# EAGLE design Lilypad_Arduino_USB (EAGLE 6.5.0)
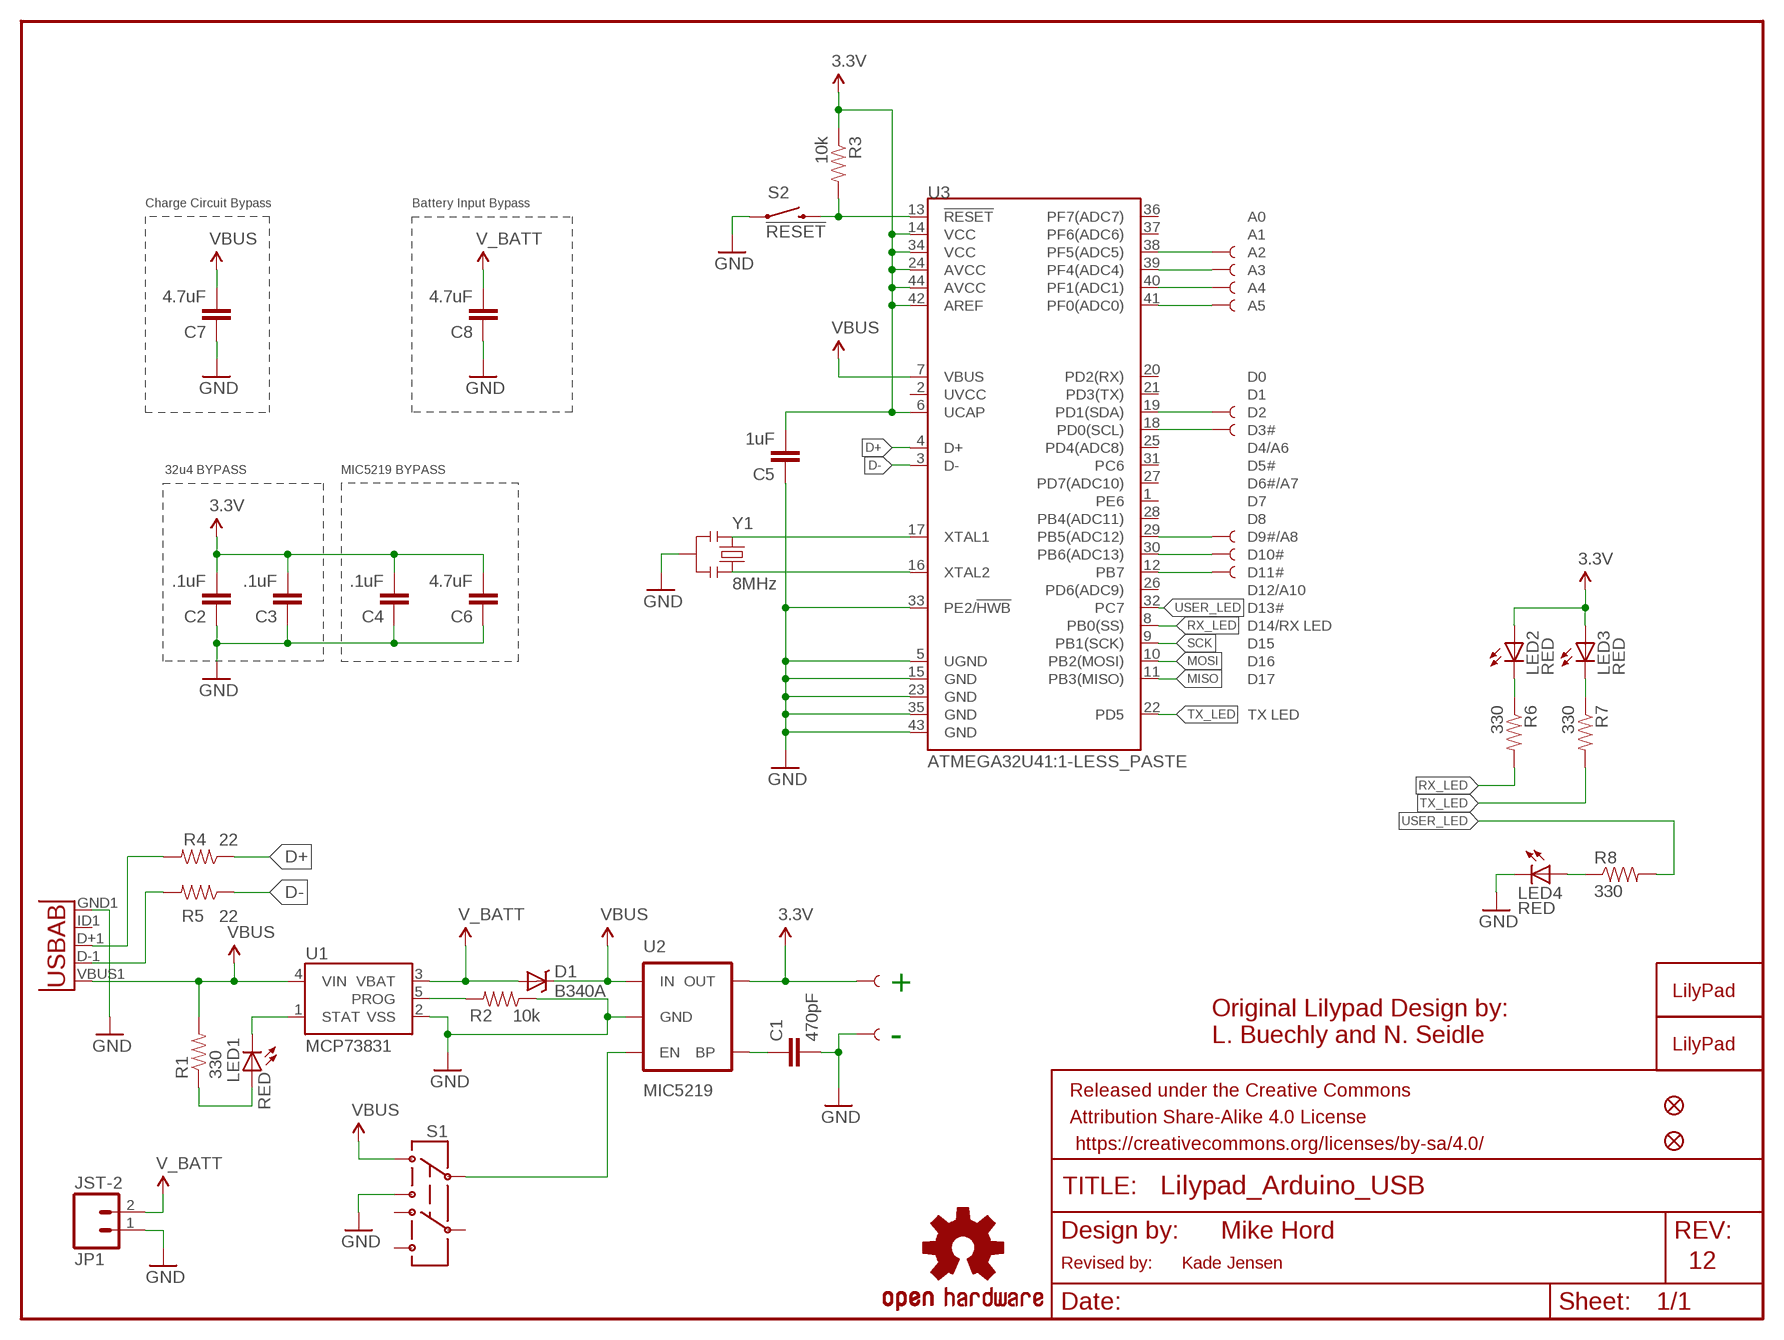
[diagram p0: schematic, sheet 1]

## Parts
+  SEWTAP9  [PETAL-LONG-1-2SIDE]
-  SEWTAP9  [PETAL-LONG-1-2SIDE]
A2  SEWTAP9  [PETAL-LONG-1-2SIDE]
A3  SEWTAP9  [PETAL-LONG-1-2SIDE]
A4  SEWTAP9  [PETAL-LONG-1-2SIDE]
A5  SEWTAP9  [PETAL-LONG-1-2SIDE]
C1  470pF  CAP0603-CAP  [0603-CAP]
C2  .1uF  CAP0603-CAP  [0603-CAP]
C3  .1uF  CAP0603-CAP  [0603-CAP]
C4  .1uF  CAP0603-CAP  [0603-CAP]
C5  1uF  CAP0603-CAP  [0603-CAP]
C6  4.7uF  CAP0603-CAP  [0603-CAP]
C7  4.7uF  CAP1206  [1206]
C8  4.7uF  CAP1206  [1206]
D1  B340A  DIODE-SCHOTTKY-B340A  [SMA-DIODE]
D5  SEWTAP9  [PETAL-LONG-1-2SIDE]
D6  SEWTAP9  [PETAL-LONG-1-2SIDE]
D9  SEWTAP9  [PETAL-LONG-1-2SIDE]
D10  SEWTAP9  [PETAL-LONG-1-2SIDE]
D11  SEWTAP9  [PETAL-LONG-1-2SIDE]
FRAME1  FRAME-LETTER  [CREATIVE_COMMONS]
JP1  JST-2  M02-JST-2MM-SMT  [JST-2-SMD]
JP2  FIDUCIAL1X2  [FIDUCIAL-1X2]
JP3  FIDUCIAL1X2  [FIDUCIAL-1X2]
LED1  RED  LED0603  [LED-0603]
LED2  RED  LED0603  [LED-0603]
LED3  RED  LED0603  [LED-0603]
LED4  RED  LED0603  [LED-0603]
R1  330  RESISTOR0603-RES  [0603-RES]
R2  10k  RESISTOR0603-RES  [0603-RES]
R3  10k  RESISTOR0603-RES  [0603-RES]
R4  22  RESISTOR0603-RES  [0603-RES]
R5  22  RESISTOR0603-RES  [0603-RES]
R6  330  RESISTOR0603-RES  [0603-RES]
R7  330  RESISTOR0603-RES  [0603-RES]
R8  330  RESISTOR0603-RES  [0603-RES]
S1  SWITCH-DPDTAYZ0202  [AYZ0202]
S2  !RESET  SWITCH-MOMENTARY-2SMD  [TACTILE_SWITCH_SMD]
U1  MCP73831  [SOT23-5]
U2  MIC5219  V_REG_MIC52193.3V  [SOT23-5]
U3  ATMEGA32U41:1-LESS_PASTE  [QFN-44-NOPAD_1:1-LESS_PASTE]
U5  USB-ABCONN-11794  [USB-AB-MICRO-SMD_V03]
U$1  LOGO-LPLPA  [LOGO-LPA]
U$5  OSHW-LOGOM  [OSHW-LOGO-M]
U$13  LOGO-LPLP  [LOGO-LILYPAD]
Y1  8MHz  RESONATOR8MHZ  [RESONATOR-SMD]

## Nets
3.3V: +.1 C2.2 C3.2 C4.2 C5.2 C6.2 LED2.A LED3.A R3.1 U2.5(OUT) U3.6(UCAP) U3.14(VCC) U3.24(AVCC) U3.34(VCC) U3.42(AREF) U3.44(AVCC)
5V: C7.2 D1.C R1.2 S1.1 U1.4(VIN) U2.1(IN) U3.7(VBUS) U5.VBUS1(VBUS) ; supply symbol labelled VBUS
D+: R4.1 U3.4(D+)
D-: R5.1 U3.3(D-)
GND: -.1 C1.2 C2.1 C3.1 C4.1 C5.1 C6.1 C7.1 C8.1 JP1.1 LED4.C R2.1 S1.3 S2.1 U1.2(VSS) U2.2(GND) U3.5(UGND) U3.15(GND) U3.23(GND) U3.33(PE2/!HWB) U3.35(GND) U3.43(GND) U5.GND1(GND) Y1.2
MISO: U3.11(PB3(MISO))
MOSI: U3.10(PB2(MOSI))
N$1: LED2.C R6.1
N$2: S1.2 U2.3(EN)
N$3: LED1.A R1.1
N$4: LED1.C U1.1(STAT)
N$5: U3.17(XTAL1) Y1.1
N$6: R2.2 U1.5(PROG)
N$7: U3.16(XTAL2) Y1.3
N$8: C1.1 U2.4(BP)
N$9: D11.1 U3.12(PB7)
N$10: D10.1 U3.30(PB6(ADC13))
N$11: D9.1 U3.29(PB5(ADC12))
N$12: D5.1 U3.19(PD1(SDA))
N$13: D6.1 U3.18(PD0(SCL))
N$14: A5.1 U3.41(PF0(ADC0))
N$15: A4.1 U3.40(PF1(ADC1))
N$16: A3.1 U3.39(PF4(ADC4))
N$17: A2.1 U3.38(PF5(ADC5))
N$18: LED4.A R8.1
N$19: R5.2 U5.D-1(D-)
N$20: R4.2 U5.D+1(D+)
N$21: LED3.C R7.1
RESET: R3.2 S2.3 U3.13(!RESET)
RX_LED: R6.2 U3.8(PB0(SS))
SCK: U3.9(PB1(SCK))
TX_LED: R7.2 U3.22(PD5)
USER_LED: R8.2 U3.32(PC7)
V_BATT: C8.2 D1.A JP1.2 U1.3(VBAT)
Unconnected: S1.4 S1.5 S1.6 U3.1(PE6) U3.2(UVCC) U3.20(PD2(RX)) U3.21(PD3(TX)) U3.25(PD4(ADC8)) U3.26(PD6(ADC9)) U3.27(PD7(ADC10)) U3.28(PB4(ADC11)) U3.31(PC6) U3.36(PF7(ADC7)) U3.37(PF6(ADC6)) U5.ID1(USBID)

## Notes on the sheet
- Charge Circuit Bypass | Battery Input Bypass
- 32u4 BYPASS | MIC5219 BYPASS
- +
- Original Lilypad Design by:
- - | L. Buechly and N. Seidle
- Mike Hord
- Revised by: | Kade Jensen | 12

## Library data of the parts
+ - A2-A5 D5 D6 D9-D11 = LilyPad-Wearables:SEWTAP; NO_PART: 1
C1 = SparkFun-Passives:CAP: Capacitor Standard 0603 ceramic capacitor, and 0.1" leaded capacitor.; PROD_ID: CAP-07884
C2-C4 = SparkFun-Passives:CAP: Capacitor Standard 0603 ceramic capacitor, and 0.1" leaded capacitor.; PROD_ID: CAP-00810
C5 = SparkFun-Passives:CAP: Capacitor Standard 0603 ceramic capacitor, and 0.1" leaded capacitor.; PROD_ID: CAP-00868
C6 = SparkFun-Passives:CAP: Capacitor Standard 0603 ceramic capacitor, and 0.1" leaded capacitor.; PROD_ID: CAP-08280
C7 C8 = SparkFun-Passives:CAP: Capacitor Standard 0603 ceramic capacitor, and 0.1" leaded capacitor.; PROD_ID: CAP-10300
D1 = SparkFun-DiscreteSemi:DIODE-SCHOTTKY: Schottky diodes in SFE's production catalog BAT20J 1A 23V 0.62Vf RB751 120mA 40V 0.37Vf PMEG4005EJ 0.5A 40V 0.42Vf MBRA140 1A 40V 0.5Vf B340A 3A 40V SMA; PROD_ID: DIO-09886
FRAME1 = SparkFun-Aesthetics:FRAME-LETTER: Schematic Frame Standard 8.5x11 US Letter frame
JP1 = SparkFun-Connectors:M02: Standard 2-pin 0.1" header. Use with - straight break away headers ( PRT-00116) - right angle break away headers (PRT-00553) - swiss pins (PRT-00743) - machine pins (PRT-00117) - female headers (PRT-00115) Molex polarized connector foot print use with: PRT-08233 with associated crimp pins and housings. 2.54_SCREWTERM for use with PRT-10571. 3.5mm Screw Terminal footprints for PRT-08084 5mm Screw Terminal footprints for use with PRT-08433; PROD_ID: CONN-08352
JP2 JP3 = SparkFun:FIDUCIAL: Fiducial Alignment Points Various fiducial points for machine vision alignment.
LED1-LED4 = SparkFun-LED:LED: LEDs Standard schematic elements and footprints for 5mm, 3mm, 1206, and 0603 sized LEDs. 5mm - Spark Fun Electronics SKU : COM-00529 (and others); PROD_ID: DIO-00819
R1 R7 R8 = SparkFun-Passives:RESISTOR: Resistor Basic schematic elements and footprints for 0603, 1206, and PTH resistors.; PROD_ID: RES-00818
R2 R3 = SparkFun-Resistors:RESISTOR: Resistor Basic schematic elements and footprints for 0603, 1206, and PTH resistors.; PROD_ID: RES-00824
R4 R5 = SparkFun-Resistors:RESISTOR: Resistor Basic schematic elements and footprints for 0603, 1206, and PTH resistors.; PROD_ID: RES-08698
R6 = SparkFun-Resistors:RESISTOR: Resistor Basic schematic elements and footprints for 0603, 1206, and PTH resistors.; PROD_ID: RES-00818
S1 = SparkFun-Electromechanical:SWITCH-DPDT: DPDT Version of the COM-00597; PROD_ID: SWCH-08179; VALUE: DPDT
S2 = SparkFun-Electromechanical:SWITCH-MOMENTARY-2: Various NO switches- pushbuttons, reed, etc; PROD_ID: SWCH-08247
U1 = SparkFun-PowerIC:MCP73831: Miniature single cell, fully integrated Li-Ion, Li-polymer charge management controller http://ww1.microchip.com/downloads/en/DeviceDoc/21984a.pdf IC-09995; PROD_ID: IC-09995
U2 = SparkFun-PowerIC:V_REG_MIC5219: V_REG MIC5219 Standard 3.3V and 5V 500mA LDO voltage regulator in SOT-23 layout. Micrel part MIC5219. BP (by-pass) pin is used to lower output noise with 470pF cap, may be left open.; PROD_ID: VREG-09872; VALUE: MIC5219 3.3V
U3 = Testing:ATMEGA32U4: Atmel 44-pin 8-bit Microcontroller with 32KBytes of ISP Flash and USB Controller; PROD_ID: IC-10828
U5 = SparkFun-Connectors:USB-AB: This is a USB AB connector that is compatible with USB OTG. i.e. this connector can serve as a host or device; PROD_ID: CONN-11794
U$1 = LilyPad-Wearables:LOGO-LP
U$5 = SparkFun:OSHW-LOGO: Open Source Hardware Logo This logo indicates the piece of hardware it is found on incorporates a OSHW license and/or adheres to the definition of open source hardware found here: http://freedomdefined.org/OSHW
U$13 = LilyPad-Wearables:LOGO-LP; NO_PART: 1
Y1 = SparkFun-FreqCtrl:RESONATOR: Resonator Small SMD resonator. Used, eg, on the Arduino Pro/ Pro Mini boards. 8MHz- XTAL-08895 16MHz- XTAL-08900; PROD_ID: XTAL-08895; VALUE: 8MHZ

## Board
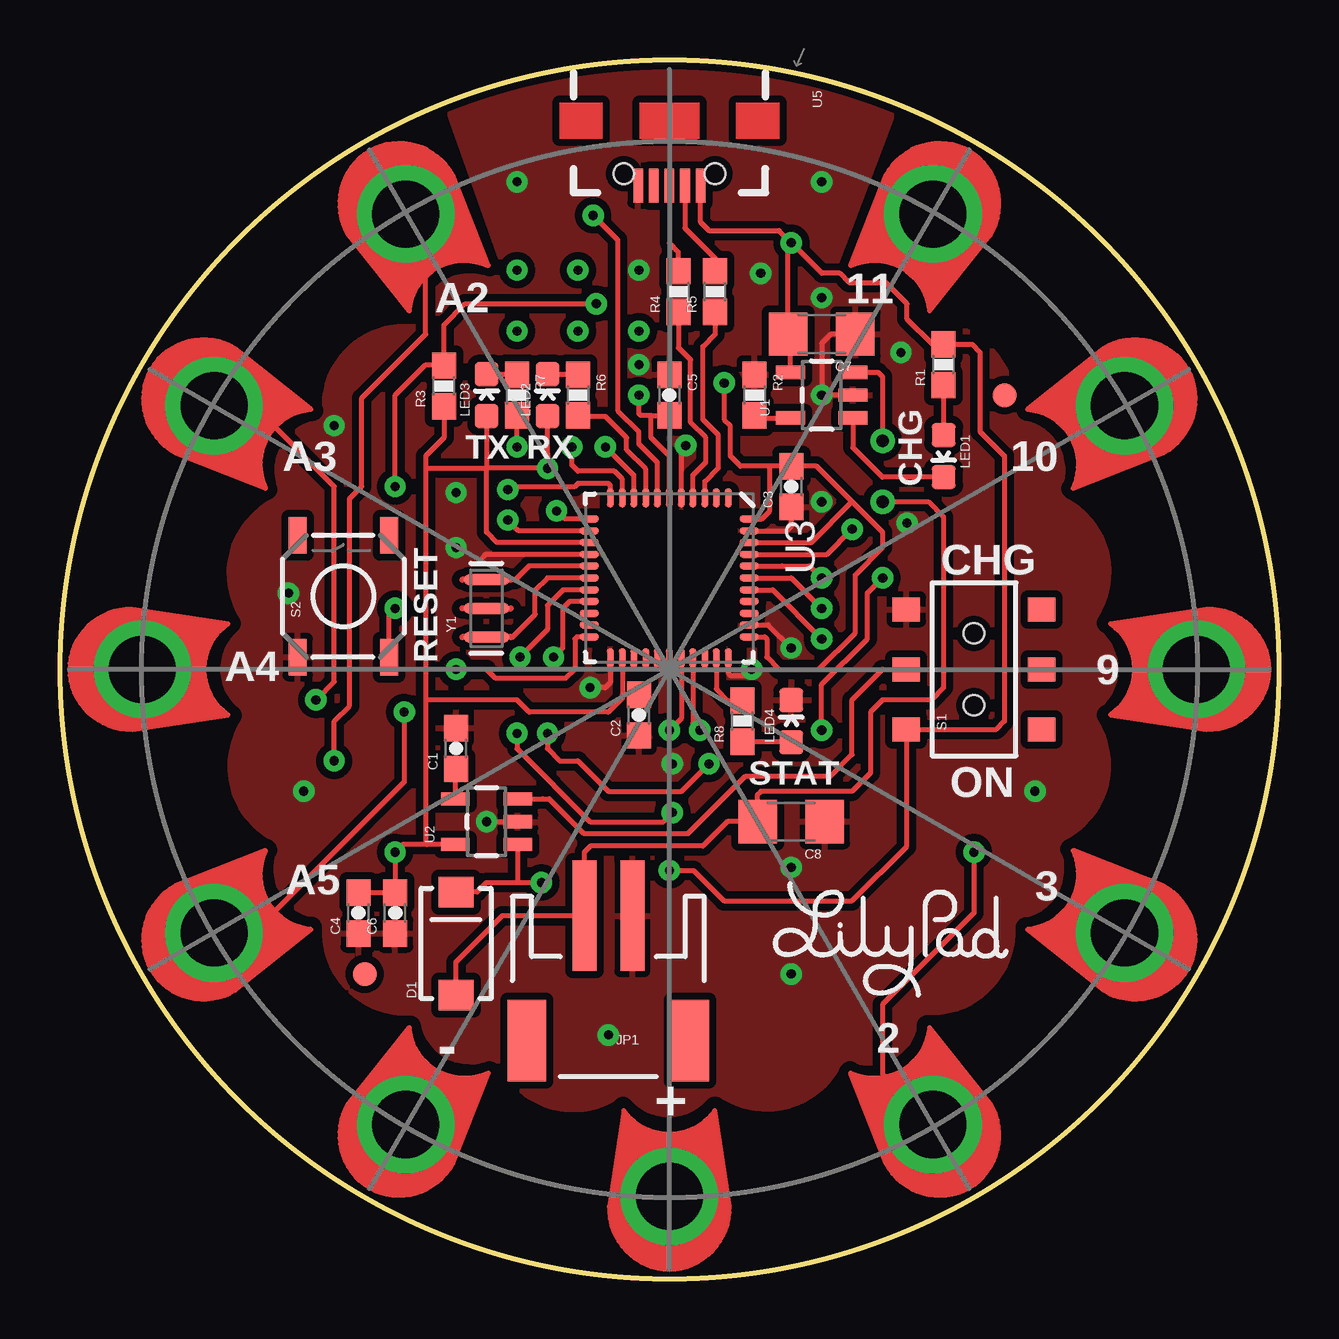
[diagram p1: board, top side]
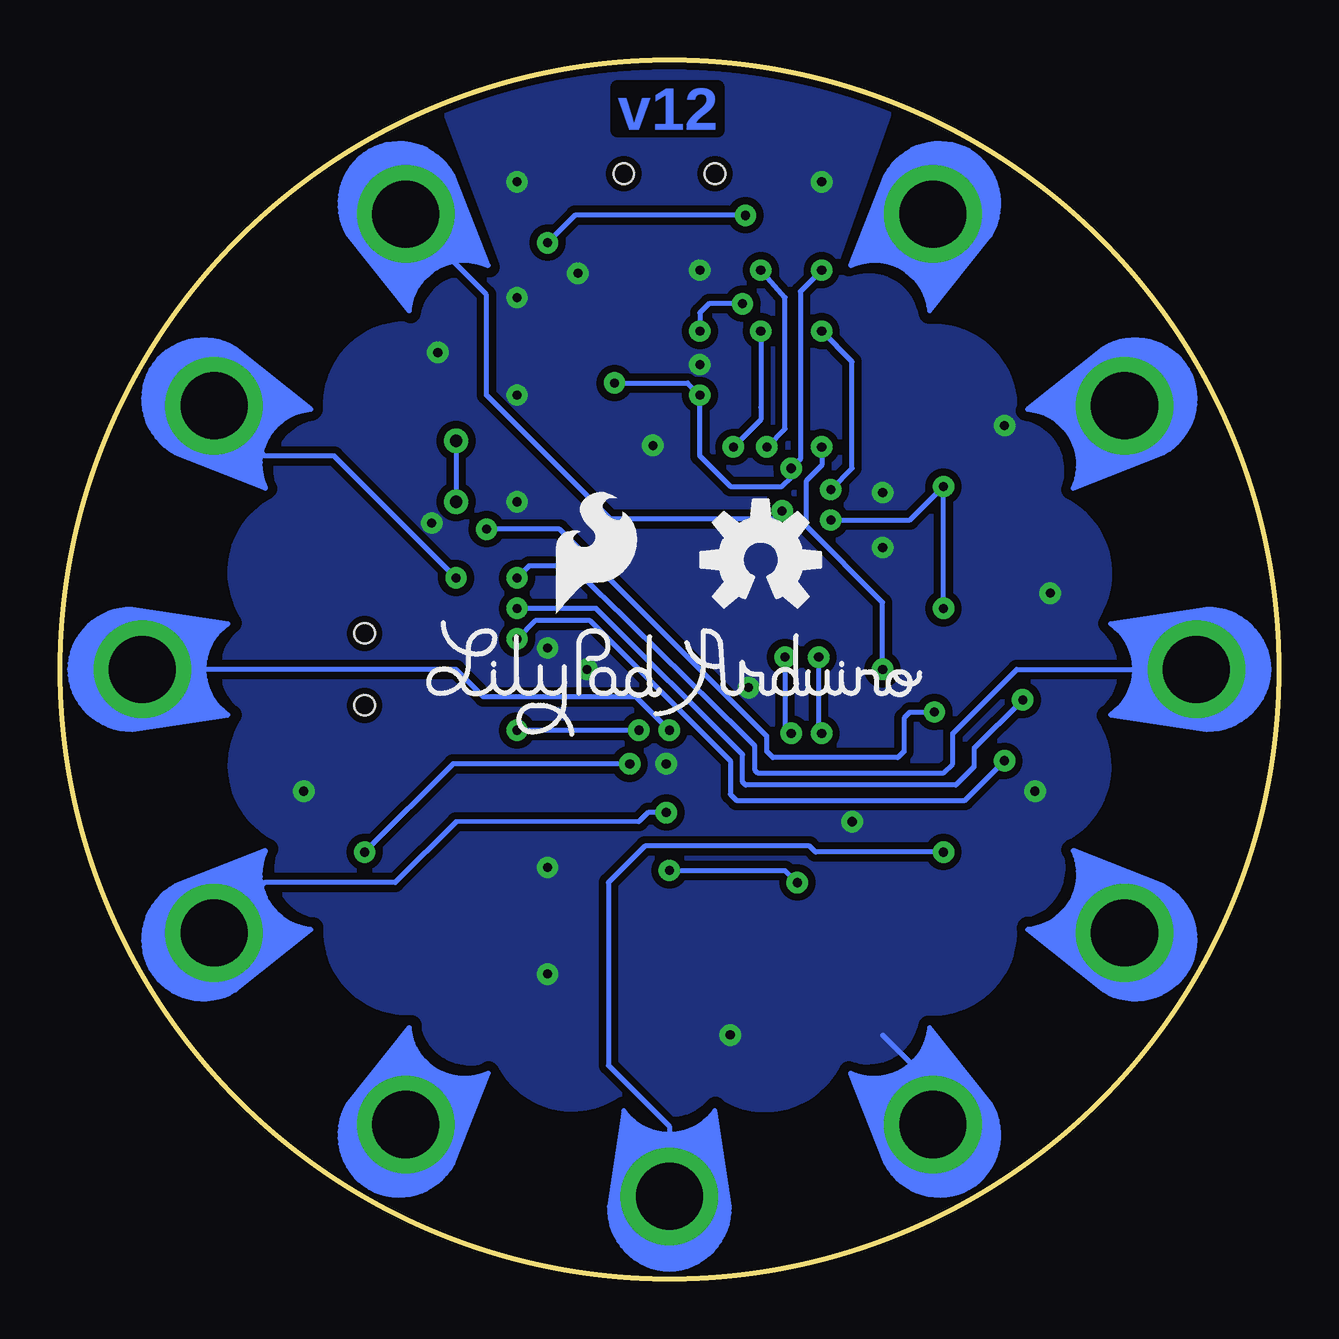
[diagram p2: board, bottom side, seen from below]

Size 50.8 x 50.8 mm. Coordinates in mm from the lower left corner, seen from the top.
Outline: circle at 25.4,25.4 radius 25.4
Copper layers (1*16): Top 0.035mm / dielectric 1.5mm / Bottom 0.035mm
Design rules "SparkFun-2-layer": minimum track width 7mil, minimum drill 15mil, track to track 8mil, track to pad 8mil, pad to pad 8mil, via to via 8mil, smd to smd 8mil, copper to edge 8mil, drill to drill 8mil, minimum pad ring 12mil, minimum via ring 10mil, stop-mask expansion 4mil, vias tented up to drill 20mil, thermal gap 10mil
tRestrict: area 2.1,32.9 to 10.5,40.7; area 40.3,10.1 to 48.7,17.9; area 0.3,22.4 to 7.1,28.6; area 43.7,22.2 to 50.5,28.4; area 32.9,2 to 40.6,10.5; area 40.3,32.9 to 48.8,40.6; area 2,10.2 to 10.5,17.9; area 10.2,40.3 to 17.9,48.8; area 32.9,40.3 to 40.7,48.7; area 10.1,2.1 to 17.9,10.5; area 0.3,27.3 to 8.6,35.3; area 5.2,36.2 to 14.6,45.6; area 42.2,27.3 to 50.5,35.3; area 36.2,36.2 to 45.6,45.6; area 5.2,5.2 to 14.6,14.7; area 0.3,15.5 to 8.6,23.5; area 27.3,0.3 to 35.3,8.6; area 15.5,0.3 to 23.5,8.6; area 36.1,5.2 to 45.6,14.6; area 42.1,15.5 to 50.5,23.5; area 22.2,0.3 to 28.4,7.2; area 22.5,25.5 to 22.6,26; area 22.9,26.7 to 27.9,31.8; area 28.1,25.8 to 28.3,26.2
bRestrict: area 0.3,22.4 to 7.1,28.6; area 43.7,22.2 to 50.5,28.4; area 32.9,2 to 40.6,10.5; area 40.3,32.9 to 48.8,40.6; area 2,10.2 to 10.5,17.9; area 10.2,40.3 to 17.9,48.8; area 32.9,40.3 to 40.7,48.7; area 10.1,2.1 to 17.9,10.5; area 0.3,27.3 to 8.6,35.3; area 5.2,36.2 to 14.6,45.6; area 42.2,27.3 to 50.5,35.3; area 36.2,36.2 to 45.6,45.6; area 5.2,5.2 to 14.6,14.7; area 0.3,15.5 to 8.6,23.5; area 27.3,0.3 to 35.3,8.6; area 15.5,0.3 to 23.5,8.6; area 36.1,5.2 to 45.6,14.6; area 42.1,15.5 to 50.5,23.5; area 22.2,0.3 to 28.4,7.2; area 2.1,32.9 to 10.5,40.7; area 40.3,10.1 to 48.7,17.9

### Footprints (pad centres in the part's own frame; a part is rotated, then mirrored left to right if it is on the bottom)
PETAL-LONG-1-2SIDE = drill 2.794 pad 4.064: 1 0.03,0
0603-CAP = smd 1.1 x 1: 1 -0.85,0; 2 0.85,0
1206 = smd 1.6 x 1.8: 1 -1.4,0; 2 1.4,0
SMA-DIODE = smd 1.27 x 1.47: A -2.15,0; C 2.15,0
JST-2-SMD = smd 1 x 4.6: 1 -1,-3.7; 2 1,-3.7 | smd 1.6 x 3.4: NC1 -3.4,1.5; NC2 3.4,1.5
FIDUCIAL-1X2 = smd 1 x 1: 1 0,0
LED-0603 = smd 1 x 1: A 0,-0.877; C 0,0.877
0603-RES = smd 1.1 x 1: 1 -0.85,0; 2 0.85,0
AYZ0202 = smd 1 x 1.15: 1 -2.5,2.825; 2 0,2.825; 3 2.5,2.825; 4 -2.5,-2.825; 5 0,-2.825; 6 2.5,-2.825 | hole 0.85: 1.5,0; -1.5,0
TACTILE_SWITCH_SMD = smd 1.524 x 0.762: 1 -2.54,1.905; 2 2.54,1.905; 3 -2.54,-1.905; 4 2.54,-1.905
SOT23-5 = smd 0.55 x 1.2: 1 -0.95,-1.3; 2 0,-1.3; 3 0.95,-1.3; 4 0.95,1.3; 5 -0.95,1.3
QFN-44-NOPAD_1:1-LESS_PASTE = smd 0.8 x 0.3: 1 -3.337,2.458; 2 -3.337,1.958; 3 -3.337,1.479; 4 -3.337,0.979; 5 -3.337,0.5; 6 -3.337,0; 7 -3.337,-0.5; 8 -3.337,-0.979; 9 -3.337,-1.479; 10 -3.337,-1.958; 11 -3.337,-2.458; 23 3.337,-2.458; 24 3.337,-1.958; 25 3.337,-1.479; 26 3.337,-0.979; 27 3.337,-0.5; 28 3.337,0; 29 3.337,0.5; 30 3.337,0.979; 31 3.337,1.479; 32 3.337,1.958; 33 3.337,2.458 | smd 0.3 x 0.8: 12 -2.458,-3.337; 13 -1.958,-3.337; 14 -1.479,-3.337; 15 -0.979,-3.337; 16 -0.5,-3.337; 17 0,-3.337; 18 0.5,-3.337; 19 0.979,-3.337; 20 1.479,-3.337; 21 1.958,-3.337; 22 2.458,-3.337; 34 2.458,3.337; 35 1.958,3.337; 36 1.479,3.337; 37 0.979,3.337; 38 0.5,3.337; 39 0,3.337; 40 -0.5,3.337; 41 -0.979,3.337; 42 -1.479,3.337; 43 -1.958,3.337; 44 -2.458,3.337
USB-AB-MICRO-SMD_V03 = smd 1.4 x 0.4: D+1 2.7,0; D-1 2.7,0.65; GND1 2.7,-1.3; ID1 2.7,-0.65; VBUS1 2.7,1.3 | hole 0.85: 2.2,1.9; 2.2,-1.9
RESONATOR-SMD = smd 0.45 x 1.905: 1 -1.2,0; 2 0,0; 3 1.2,0

### Placement (x,y rotation side)
+  25.4,3.4 90 top
-  14.4,6.4 60 top
A2  14.4,44.4 300 top
A3  6.4,36.4 330 top
A4  3.4,25.4 0 top
A5  6.4,14.4 30 top
C1  16.51,22.1 90 top
C2  24.13,23.5 90 top
C3  30.48,33.02 90 top
C4  12.45,15.24 90 top
C5  25.4,36.83 270 top
C6  13.97,15.24 90 top
C7  31.75,39.37 180 top
C8  30.48,19.05 180 top
D1  16.51,13.97 90 top
D5  36.4,6.4 120 top
D6  44.4,14.4 150 top
D9  47.4,25.4 180 top
D10  44.4,36.4 210 top
D11  36.4,44.4 240 top
FRAME1  -87.91,25.4 0 top  (outside the outline)
JP1  22.86,11.43 180 top
JP2  12.7,12.7 0 top
JP3  39.37,36.83 0 top
LED1  36.83,34.29 180 top
LED2  20.32,36.83 0 top
LED3  17.78,36.83 0 top
LED4  30.48,23.24 0 top
R1  36.83,38.1 90 top
R2  28.96,36.83 270 top
R3  16,37.21 90 top
R4  25.78,41.15 90 top
R5  27.3,41.15 90 top
R6  21.59,36.83 270 top
R7  19.05,36.83 270 top
R8  28.45,23.24 90 top
S1  38.1,25.4 90 top
S2  11.81,28.45 90 top
U1  31.75,36.83 90 top
U2  17.78,19.05 90 top
U3  25.4,29.21 270 top
U5  25.4,48.26 270 top
U$1  25.4,25.4 0 bottom
U$5  21.59,29.97 0 bottom
U$7  [SFE_LOGO_FLAME_.2]  30.48,27.43 0 bottom
U$13  34.67,14.48 0 top
Y1  17.78,27.94 90 top

### Tracks (layer width: path | path; a pad name or v marks a point on that pad's centre or on a via)
3.3V  (via drill 0.38)
  Top 0.203: 16.19,18.1 U2.5 15.3,18.1 | LED2.A 20.32,34.42 v20.32,33.78 17.78,33.78 | 15.3,18.1 15.24,18.16 15.24,24.13 | 15.3,18.1 14.29,18.1 v13.97,17.78 C6.2 C4.2 | R3.1 16,35.05 15.24,34.29 15.24,33.78 | 29.59,33.87 C3.2 31.53,33.87 33.02,32.38 | U3.44 29.25,31.67 29.59,32 29.59,33.87 | 15.24,24.13 19.05,24.13 19.56,23.62 22.86,23.62 23.44,24.2 23.44,24.34 | U3.24 23.44,24.34 | C2.2 23.44,24.34 | 24.64,35.98 24.22,35.98 24.13,36.07 v24.13,36.83 | U3.6 25.4,34.29 24.64,35.05 24.64,35.98 | 24.64,35.98 C5.2 | v27.69,37.34 27.69,35.81 27.94,35.56 27.94,34.29 28.36,33.87 29.59,33.87 | U3.34 29.38,26.75 29.46,26.67 29.46,25.91 29.97,25.4 31.62,25.4 33.15,26.92 33.15,29.34 34.29,30.48 34.29,31.11 33.02,32.38 | U3.42 31.32,30.69 33.02,32.38 | U3.14 18.21,30.69 17.78,31.11 17.78,33.78 | 15.24,33.78 17.78,33.78 | 17.78,33.78 | 17.78,33.78 | LED3.A 17.78,33.78 | 17.78,33.78 | 15.24,33.78 | 15.24,33.78 15.24,24.13
  Bottom 0.203: v19.05,42.04 19.94,41.15 19.94,34.16 v20.32,33.78 | v13.97,17.78 19.3,17.78 19.56,18.03 26.42,18.03 27.94,16.51 27.94,8.89 25.4,6.35 +.1 | v20.32,33.78 | v20.32,33.78 20.32,33.4 20.7,33.02 22.86,33.02 24.13,34.29 v24.13,36.83 24.64,37.34 v27.69,37.34
5V  (via drill 0.38)
  Top 0.203: U3.7 24.9,34.03 24.13,34.8 24.13,35.31 23.24,36.2 23.24,43.31 v22.22,44.32 | v25.4,17.02 26.42,17.02 27.69,15.75 33.02,15.75 35.27,18 S1.1 39.03,22.9 39.37,23.24 39.37,34.29 38.35,35.31 38.35,38.61 38.01,38.95 R1.2 36.36,38.95 35.31,40 35.31,40.64 34.42,41.53 32.89,41.53 32.51,41.91 31.75,41.91 v30.48,43.18 | v30.48,43.18 29.97,43.69 27.05,43.69 26.7,44.04 U5.VBUS1 | v30.48,43.18 30.35,43.05 C7.2 30.45,39.27 U1.4 | 19.05,16.51 17.78,16.51 17.39,16.12 D1.C | 19.05,16.51 v20.07,16.51 | v20.07,16.51 | U2.1 19.08,16.54 19.05,16.51 | D1.C | U5.VBUS1
  Bottom 0.203: v22.22,44.32 29.34,44.32 v30.48,43.18 | v25.4,17.02 20.57,17.02 v20.07,16.51
D+
  Top 0.203: R4.1 25.78,38.81 26.29,38.3 26.29,35.69 26.92,35.05 26.92,34.04 26.38,33.49 U3.4
D-
  Top 0.203: R5.1 27.3,39.37 26.8,38.86 26.8,35.81 27.43,35.18 27.43,33.78 26.88,33.23 U3.3
GND  (via drill 0.38)
  Top 0.203: U1.2 v31.75,36.83 31.75,38.99 32.13,39.37 C7.1 | U2.2 v17.78,19.05 | C3.1 30.48,31.37 30.28,31.17 U3.43 | U3.15 17.74,30.19 17.65,30.1 | U3.23 22.94,24.85 22.73,24.64 v22.1,24.64 | U3.5 25.9,34.55 v26.09,34.73 | U3.33 27.86,25.23 27.94,25.15 28.57,25.15 v28.83,25.4 | U3.35 29.52,27.25 v30.48,26.29
  Bottom 0.203: -.1 14.41,8.06 16.51,10.16
  other vias: 24.13,42.04 22.86,10.16 30.48,12.7 10.16,20.32 29.21,41.91 9.53,28.57 24.13,38.1 31.75,40.89 19.05,45.72 16.51,30.48 16.51,32.77 35.31,31.5 31.75,32.38 25.53,21.46 30.48,17.14 35.05,38.61 11.43,35.56 31.75,45.72 40.64,20.32
  pour Top (isolate 0.305): 50.8,25.4 arc90 25.4,50.8 arc90 0,25.4 arc90 25.4,0 arc90
  pour Bottom (isolate 0.305): 50.8,25.4 arc90 25.4,50.8 arc90 0,25.4 arc90 25.4,0 arc90
MISO  (via drill 0.38)
  Top 0.203: v18.67,32.89 18.8,33.02 21.46,33.02 21.59,33.15 22.86,33.15 22.94,33.06 U3.11
  Bottom 0.203: 17.78,33.78 17.78,38.23 v19.05,39.5 | 17.78,33.78 | 17.78,33.78 v18.67,32.89
MOSI  (via drill 0.38)
  Top 0.203: U3.10 23.44,33.33 23.11,33.66 21.59,33.66 21.34,33.91 v21.34,34.67
  Bottom 0.203: v21.59,42.04 20.57,40.89 20.57,35.43 v21.34,34.67
N$1
  Top 0.203: LED2.C 21.56,37.71 R6.1
N$2
  Top 0.203: U2.3 20.13,20 20.39,20 21.84,18.54 26.16,18.54 28.57,20.95 32.13,20.95 33.02,21.84 33.02,24.13 34.29,25.4 S1.2
N$3
  Top 0.203: R1.1 LED1.A
N$4
  Top 0.203: U1.1 33.05,34.64 34.28,33.41 LED1.C
N$5
  Top 0.203: Y1.1 18.87,26.74 19.81,27.69 19.81,28.7 20.32,29.21 | U3.17 20.32,29.21 | 20.32,29.21
N$6
  Top 0.203: R2.2 arc90 29.06,35.88 U1.5
N$7
  Top 0.203: Y1.3 18.98,29.14 19.55,29.71 U3.16
N$8
  Top 0.203: U2.4 16.48,21.22
  Top 0.254: 16.48,21.22 C1.1
N$9  (via drill 0.38)
  Top 0.203: U3.12 21.04,31.67 v20.7,32
  Bottom 0.203: v20.7,32 21.04,31.67 27.86,31.67 33.02,36.83 33.02,41.01 D11.1
N$10  (via drill 0.38)
  Top 0.203: v31.75,22.86 31.75,24.76 33.66,26.67 33.66,28.57 v34.29,29.21 | U3.30 26.38,23.15 v26.67,22.86
  Bottom 0.203: v26.67,22.86 v31.75,22.86 | v34.29,29.21 39.37,34.29 42.28,34.29 D10.1
N$11  (via drill 0.38)
  Top 0.203: U3.29 25.9,23.36 v25.4,22.86
  Bottom 0.203: v25.4,22.86 26.8,24.26 33.15,24.26 34.29,25.4 D9.1
N$12  (via drill 0.38)
  Top 0.203: v20.32,22.73 20.32,22.1 20.83,21.59 21.59,21.59 22.86,20.32 25.91,20.32 v27.05,21.46 | v38.1,17.78 38.1,15.24 34.29,11.43 34.29,8.52 D5.1 | U3.19 21.25,28.23 20.95,27.94 20.95,26.29 v20.57,25.91
  Bottom 0.203: v27.05,21.46 34.42,21.46 v38.1,17.78 | v20.57,25.91 20.57,22.99 v20.32,22.73
N$13  (via drill 0.38)
  Top 0.203: v19.05,22.73 19.05,22.1 22.1,19.05 25.15,19.05 v25.53,19.43 | U3.18 20.96,28.71 20.32,28.07 20.32,27.05 v19.18,25.91
  Bottom 0.203: D6.1 42.28,16.51 36.83,16.51 34.29,19.05 26.67,19.05 26.29,19.43 v25.53,19.43 | v19.18,25.91 19.18,22.86 v19.05,22.73
N$14  (via drill 0.38)
  Top 0.203: v14.35,23.62 14.35,20.7 7.62,13.97 6.87,13.97 A5.1 | U3.41 31.97,30.19 v33.02,31.24
  Bottom 0.203: v14.35,23.62 15.37,23.62 15.62,23.37 15.62,21.97 15.87,21.72 21.08,21.72 21.34,21.97 21.34,22.61 29.97,31.24 v33.02,31.24
N$15  (via drill 0.38)
  Top 0.203: U3.40 30.11,29.71 31.25,29.71 v31.75,29.21
  Bottom 0.203: A4.1 10.92,25.4 13.59,22.73 13.59,21.46 13.97,21.08 21.72,21.08 21.84,21.21 21.84,22.22 22.35,22.73 28.19,28.45 28.2,28.45 29.46,29.71 31.25,29.71 v31.75,29.21
N$16  (via drill 0.38)
  Top 0.203: v10.67,24.13 11.43,24.89 11.43,33.02 8.06,36.38 A3.1 | U3.39 30.48,29.21 v31.75,27.94
  Bottom 0.203: v10.67,24.13 12.7,22.1 12.7,21.34 13.46,20.57 22.22,20.57 22.35,20.7 22.35,21.84 28.45,27.94 v31.75,27.94
N$17  (via drill 0.38)
  Top 0.203: U3.38 29.71,28.71 v31.75,26.67 | v11.43,21.59 11.43,23.24 12.06,23.88 12.06,32.51 12.57,33.02 12.57,36.7 15.24,39.37 15.24,43.55 A2.1 14.35,44.31
  Bottom 0.203: v11.43,21.59 13.08,19.94 22.61,19.94 22.86,20.19 22.86,21.59 28.7,27.43 30.99,27.43 v31.75,26.67
N$18
  Top 0.203: R8.1 30.45,22.39 LED4.A
N$19
  Top 0.203: R5.2 27.3,42.55 26.05,43.8 U5.D-1 | U5.D-1
N$20
  Top 0.203: R4.2 25.78,42.8 25.4,43.18 U5.D+1
N$21
  Top 0.203: LED3.C 19.02,37.71 R7.1
RESET  (via drill 0.38)
  Top 0.203: v18.67,31.62 19.08,31.21 19.12,31.17 U3.13 | v22.35,40.64 16.89,40.64 16,39.75 R3.2 15.96,38.1 15.24,38.1 13.97,36.83 v13.97,33.02 | S2.3 13.72,27.69 v13.97,27.94
  Bottom 0.203: v22.35,40.64 23.75,40.64 24.13,40.26 v24.13,39.5 | v18.67,31.62 15.37,31.62 v13.97,33.02 | v13.97,27.94 v13.97,33.02 | v13.97,33.02
RX_LED
  Top 0.203: U3.8 24.42,33.74 23.62,34.54 23.62,35.05 22.73,35.94 21.63,35.94 R6.2
SCK  (via drill 0.38)
  Top 0.203: U3.9 23.92,33.48 v22.73,34.67
  Bottom 0.203: v21.59,39.5 21.59,36.32 21.59,35.81 v22.73,34.67
TX_LED  (via drill 0.38)
  Top 0.203: v19.05,34.67 R7.2 | v16.51,25.4 17.78,25.4 18.16,25.02 21.08,25.02 21.46,25.4 21.46,26.67 21.54,26.75 U3.22
  Bottom 0.203: v19.05,34.67 19.05,33.91 19.68,33.27 19.68,31.37 16.51,28.19 v16.51,25.4
USER_LED
  Top 0.203: R8.2 27.85,24.09 27.4,24.54 27.36,24.58 U3.32
V_BATT  (via drill 0.51)
  Top 0.203: U1.3 34.1,37.78 34.29,37.59 v34.29,34.92 | v34.29,32.38 36.2,32.38 36.83,31.75 36.83,24.64 36.32,24.13 34.29,24.13 33.78,23.62 33.78,21.08 33.02,20.32 29.21,20.32 29.08,20.19 C8.2 27.81,19.05 26.8,18.03 22.11,18.03 21.86,17.78 JP1.2 18.43,15.13 16.51,13.21 D1.A
  Bottom 0.203: v34.29,34.92 v34.29,32.38

### Text on the board
Bottom: v12
tPlace: A2 | 11 | TX | RX | A3 | CHG | 10 | RESET | CHG | A4 | 9 | STAT | ON | A5 | 3 | 2 | - | +
tDocu: Mike Hord | Revised by: Kade Jensen